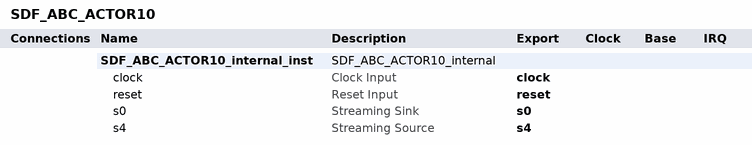
[diagram p0: system contents]
# Platform Designer (Qsys) system SDF_ABC_ACTOR10, Cyclone V 5CSEBA6U23I7
# Parameters at their usual value, and those the tool derives, are not listed.
package require qsys
create_system SDF_ABC_ACTOR10
set_project_property DEVICE_FAMILY {Cyclone V}
set_project_property DEVICE 5CSEBA6U23I7

add_instance SDF_ABC_ACTOR10_internal_inst SDF_ABC_ACTOR10_internal 1.0
set_instance_property SDF_ABC_ACTOR10_internal_inst AUTO_EXPORT true

# exported interfaces
add_interface clock clock sink
set_interface_property clock EXPORT_OF SDF_ABC_ACTOR10_internal_inst.clock
add_interface reset reset sink
set_interface_property reset EXPORT_OF SDF_ABC_ACTOR10_internal_inst.reset
add_interface s0 avalon_streaming sink
set_interface_property s0 EXPORT_OF SDF_ABC_ACTOR10_internal_inst.s0
add_interface s4 avalon_streaming source
set_interface_property s4 EXPORT_OF SDF_ABC_ACTOR10_internal_inst.s4

set_interconnect_requirement {$system} qsys_mm.clockCrossingAdapter HANDSHAKE
set_interconnect_requirement {$system} qsys_mm.enableEccProtection FALSE
set_interconnect_requirement {$system} qsys_mm.insertDefaultSlave FALSE
set_interconnect_requirement {$system} qsys_mm.maxAdditionalLatency 1

save_system SDF_ABC_ACTOR10.qsys
